# Altium schematic sheet MezzanineDCDC_8045.SchDoc: Mezzanine DCDC PCB - LTM8045
size B; Date: 9/7/2021; Engineer: J. Juneau; DocumentNumber: 1006; Revision: 1.2; SheetNumber: 4; SheetTotal: 4
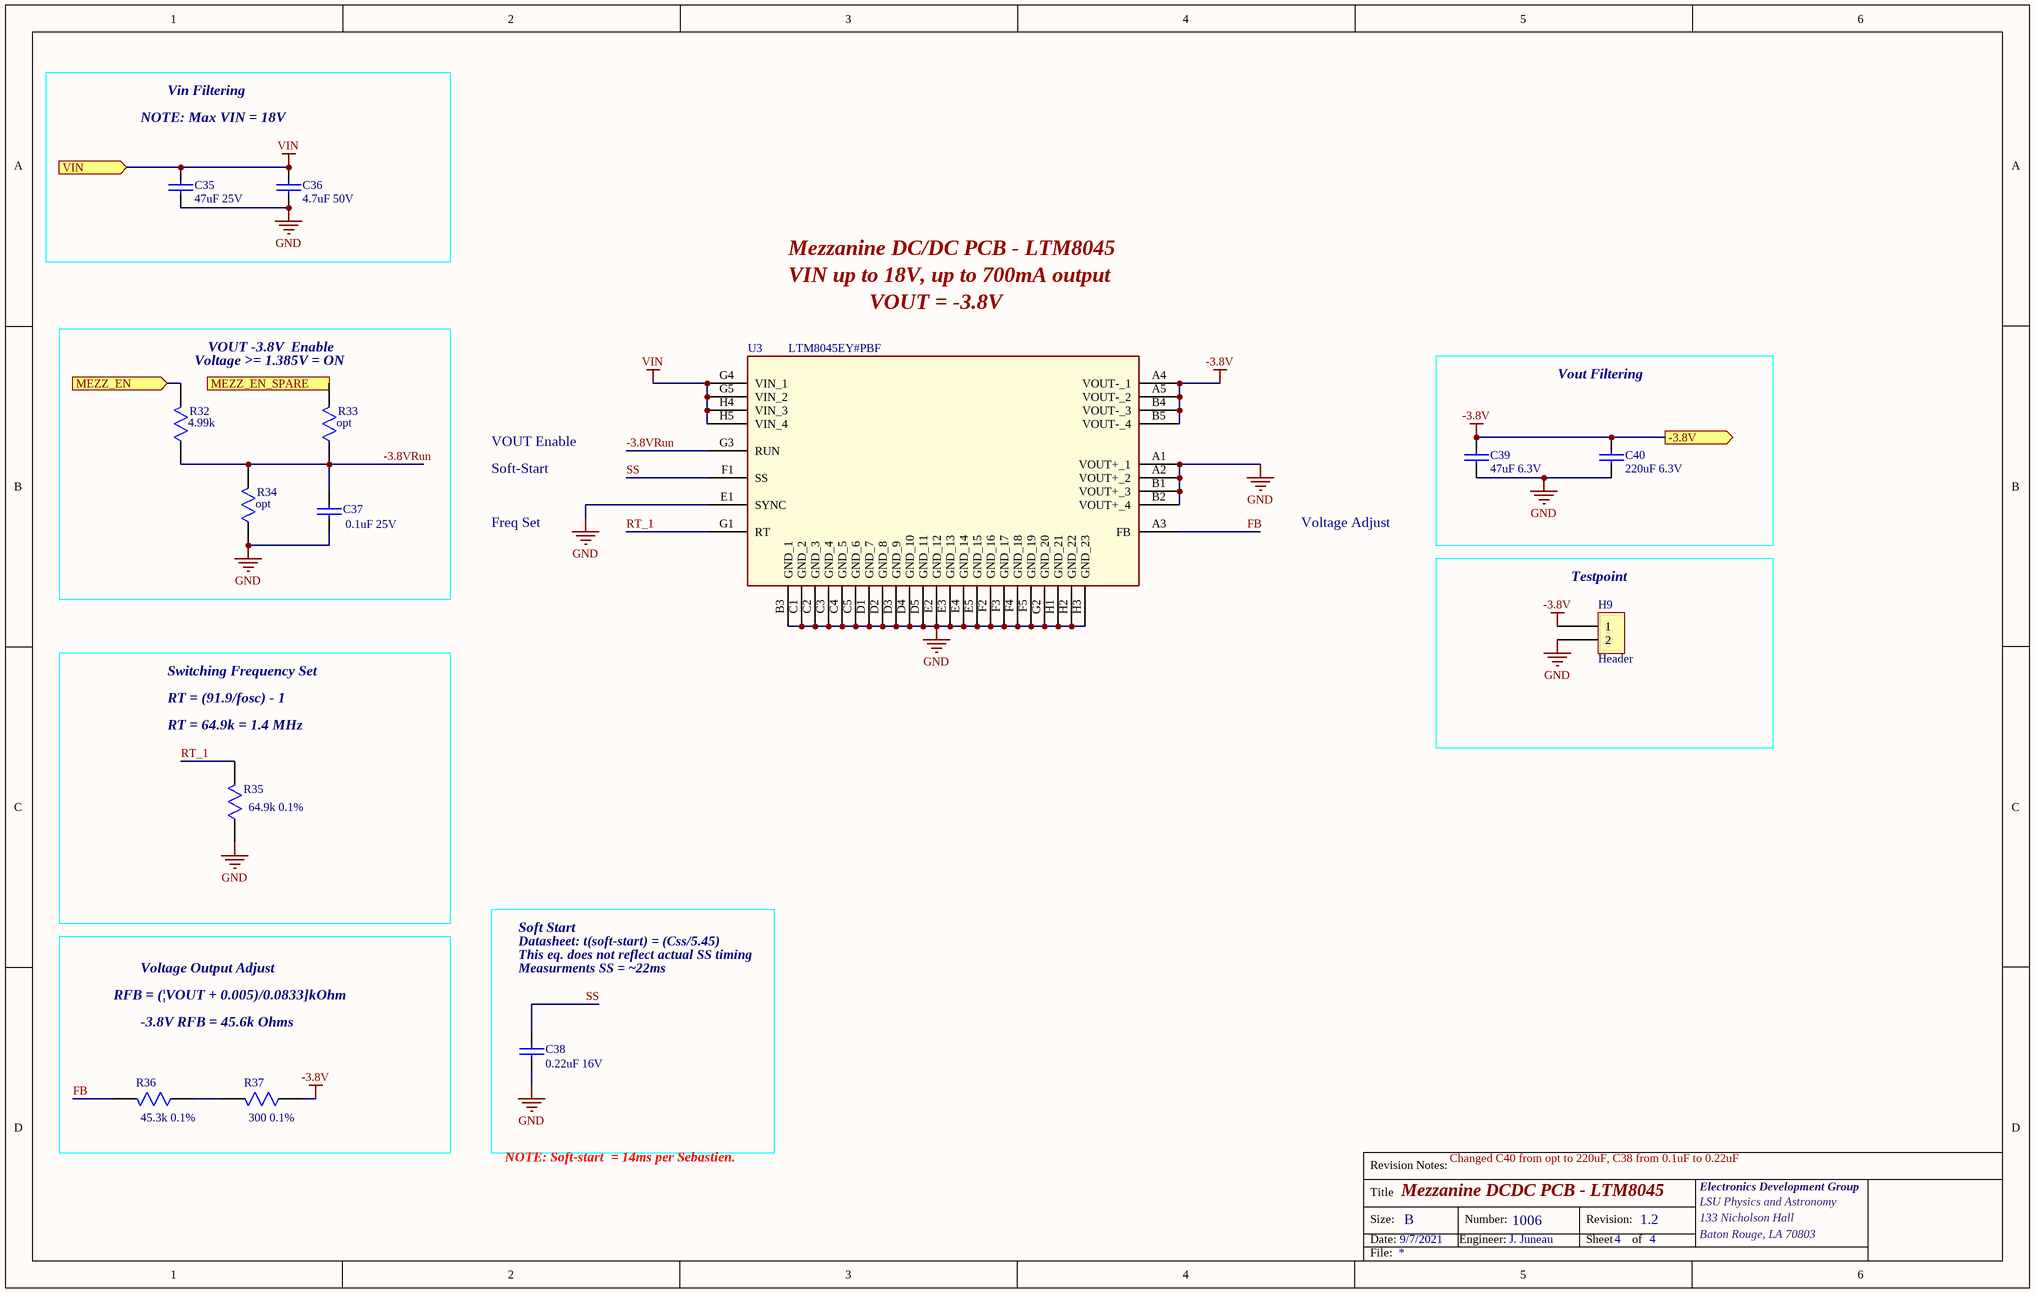
[diagram p0: MezzanineDCDC_8045.SchDoc]

## Parts
C35  value 47uF 25V  [CAP 1206 TDK]  (hidden comment: C3216X5R1E476M160AC)
C36  value 4.7uF 50V  [CAP 1206 TDK]  (hidden comment: UMK316BJ475KL-T)
C37  value 0.1uF 25V  [Cap 0603 TDK]  (hidden comment: C1608X7R1E104K080AA)
C38  value 0.22uF 16V  [Cap 0603 TDK]  (hidden comment: 0603YD224KAT2A)
C39  value 47uF 6.3V  [CAP 1206 TDK 2.3 Height]  (hidden comment: 12066D476MAT4A)
C40  value 220uF 6.3V  [CAP 1206 TDK 2.3 Height]  (hidden comment: GRM31CR60J227ME11L)
H9  Header  [Header 2Pin]
R32  value 4.99k  [Resistor ERJ2G/CRCW 0402]  (hidden comment: CRCW04024K99FKED)
R33  opt  [Resistor ERJ2G/CRCW 0402]
R34  opt  [Resistor ERJ2G/CRCW 0402]
R35  value 64.9k 0.1%  [Resistor 0603 - ERJ]  (hidden comment: ERJ-PB3B6492V)
R36  value 45.3k 0.1%  [Resistor 0603 - ERJ]  (hidden comment: ERA-3AEB4532V)
R37  value 300 0.1%  [Resistor 0603 - ERJ]  (hidden comment: ERA-3AEB301V)
U3  LTM8045EY#PBF  [LTM8045]

## Blocks framed on the sheet
Vout Filtering: C39 C40
Testpoint: H9
Soft Start: C38

## Ports
-3.8V (out), MEZZ_EN (in), MEZZ_EN_SPARE (in), VIN (in)

## Nets
-3.8V: C39.1 C40.1 H9.1 R37.1 U3.A4(VOUT-_1) U3.A5(VOUT-_2) U3.B4(VOUT-_3) U3.B5(VOUT-_4) ; port -3.8V
GND: C35.2 C36.2 C37.2 C38.2 C39.2 C40.2 H9.2 R34.1 R35.1 U3.A1(VOUT+_1) U3.A2(VOUT+_2) U3.B1(VOUT+_3) U3.B2(VOUT+_4) U3.B3(GND_1) U3.C1(GND_2) U3.C2(GND_3) U3.C3(GND_4) U3.C4(GND_5) U3.C5(GND_6) U3.D1(GND_7) U3.D2(GND_8) U3.D3(GND_9) U3.D4(GND_10) U3.D5(GND_11) U3.E1(SYNC) U3.E2(GND_12) U3.E3(GND_13) U3.E4(GND_14) U3.E5(GND_15) U3.F2(GND_16) U3.F3(GND_17) U3.F4(GND_18) U3.F5(GND_19) U3.G2(GND_20) U3.H1(GND_21) U3.H2(GND_22) U3.H3(GND_23)
VIN: C35.1 C36.1 U3.G4(VIN_1) U3.G5(VIN_2) U3.H4(VIN_3) U3.H5(VIN_4) ; port VIN
-3.8VRun: C37.1 R32.1 R33.1 R34.2 U3.G3(RUN)
FB: R36.2 U3.A3(FB)
MEZZ_EN: R32.2 ; port MEZZ_EN
MEZZ_EN_SPARE: R33.2 ; port MEZZ_EN_SPARE
RT_1: R35.2 U3.G1(RT)
SS: C38.1 U3.F1(SS)
NetR36_1: R36.1 R37.2

## Notes on the sheet
- Vin Filtering
- NOTE: Max VIN = 18V
- Mezzanine DC/DC PCB - LTM8045
- VIN up to 18V, up to 700mA output
- Voltage >= 1.385V = ON
- VOUT -3.8V  Enable
- VOUT = -3.8V
- VOUT Enable
- Soft-Start
- Freq Set
- Voltage Adjust
- Switching Frequency Set
- RT = (91.9/fosc) - 1
- (near R35) RT = 64.9k = 1.4 MHz
- Voltage Output Adjust
- Datasheet: t(soft-start) = (Css/5.45)
- This eq. does not reflect actual SS timing
- Measurments SS = ~22ms
- RFB = (|VOUT + 0.005)/0.0833]kOhm
- -3.8V RFB = 45.6k Ohms
- NOTE: Soft-start  = 14ms per Sebastien.
- Changed C40 from opt to 220uF, C38 from 0.1uF to 0.22uF
- Revision Notes:
- Title
- Size:
- Date:
- B
- Engineer:
- Number:
- Revision:
- Sheet
- of
- Electronics Development Group
- LSU Physics and Astronomy
- 133 Nicholson Hall
- Baton Rouge, LA 70803
- File:

## Library data of the parts
C35 = Capacitor 1206: 47µF ±20% 25V Ceramic Capacitor X5R 1206 (3216 Metric); Dimensions: 3.2x1.6x1.8mm; ComponentLink1Description: Digikey; ComponentLink1URL: https://www.digikey.com/en/products/detail/taiyo-yuden/UMK316BJ475KL-T/1646591?s=N4IgTCBcDaIKoFkDSBmAjANgEICkAsA7AKxIAyAtACogC6AvkA
C36 = Capacitor 1206: 4.7µF ±10% 50V Ceramic Capacitor X5R 1206 (3216 Metric); Dimensions: 3.2x1.6x1.8mm; ComponentLink1Description: Digikey; ComponentLink1URL: https://www.digikey.com/en/products/detail/taiyo-yuden/UMK316BJ475KL-T/1646591?s=N4IgTCBcDaIKoFkDSBmAjANgEICkAsA7AKxIAyAtACogC6AvkA
C37 = Capacitor 0603 TDK: CAP CER 0.1UF 25V X7R 0603; ComponentLink1Description: Digikey; ComponentLink1URL: https://www.digikey.com/en/products/detail/tdk-corporation/C1608X7R1E104K080AA/513803?s=N4IgTCBcDaIMIEYBsAGAHADQOwCUEFEEUAWAaXRQEFKACEAXQF8g
C38 = Capacitor 0603 TDK: 0.22 µF ±10% 16V Ceramic Capacitor X5R 0603 (1608 Metric); ComponentLink1Description: Digikey
C39 = Capacitor 1206 2.3mmHeight: 47µF ±20% 6.3V Ceramic Capacitor X5R 1206 (3216 Metric); Dimensions: 3.2x1.6x2.3mm; ComponentLink1Description: Digikey; ComponentLink1URL: https://www.digikey.com/en/products/detail/avx-corporation/12066D476MAT4A/8107694?s=N4IgTCBcDaIIxgAwDZkBEAsB2ZBZAggCob4gC6AvkA
C40 = Capacitor 1206 2.3mmHeight: 220 µF ±20% 6.3V Ceramic Capacitor X5R 1206 (3216 Metric); ComponentLink1Description: Digikey; ComponentLink1URL: https://www.digikey.com/en/products/detail/murata-electronics/GRM31CR60J227ME11L/6155740*
H9 = Header - 2Pin: Connector Header Through Hole 2 position 0.100" (2.54mm); ComponentLink1Description: Digikey; ComponentLink1URL: https://www.digikey.com/en/products/detail/amphenol-icc-fci/68001-202HLF/2023308
R32 = ERJ2G Resistor 0402: RES, Thick Film, 4.99 kOhm, 1.0 %, 1/16 W, SMD, 0402; ComponentLink1Description: Digikey; ComponentLink1URL: https://www.digikey.com/en/products/detail/vishay-dale/CRCW04024K99FKED/1178086
R33 R34 = ERJ2G Resistor 0402: Resistor 0402; Value: opt
R35 = Resistor 0603: 64.9 ±0.1% 0.2W, 1/5W Chip Resistor 0603 (1608 Metric) Automotive AEC-Q200, Pulse Withstanding Thick Film; ComponentLink1Description: Digikey; ComponentLink1URL: https://www.digikey.com/en/products/detail/panasonic-electronic-components/ERJ-PB3B6492V/6212962
R36 = Resistor 0603: RES SMD 45.3KOHM 0.1% 1/10W 0603; ComponentLink1Description: Digikey; ComponentLink1URL: https://www.digikey.com/en/products/detail/panasonic-electronic-components/ERA-3AEB4532V/2026897?s=N4IgTCBcDaIKICUCCBaAzEuAhALAVjTADUQBdAXyA
R37 = Resistor 0603: RES SMD 300 OHM 0.1% 1/10W 0603; ComponentLink1Description: Digikey; ComponentLink1URL: https://www.digikey.com/en/products/detail/panasonic-electronic-components/ERA-3AEB301V/1465841?s=N4IgTCBcDaIKICUCCBaAzEuAhNAGAjAGogC6AvkA
U3 = LTM8045: Non-Isolated PoL Module DC DC Converter Output -2.5 ~ -15V, 2.5 ~ 15V - - 700mA 2.8V - 18V Input; ComponentLink1Description: Digikey; ComponentLink1URL: https://www.digikey.com/en/products/detail/analog-devices-inc/LTM8045IY-PBF/3883289